# EAGLE design smartFootballTable_Display (EAGLE 8.1.1)
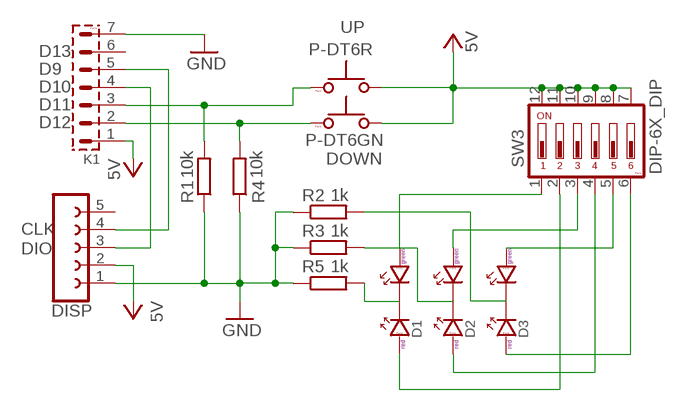
[diagram p0: schematic, sheet 1]

## Parts
D1  LED_DUO_3  [LED_3-DUO]
D2  LED_DUO_3  [LED_3-DUO]
D3  LED_DUO_3  [LED_3-DUO]
DISP  FE05W  [FE05W]
DOWN  P-DT6GN  P-DT6E  [P-DTE6]
K1  PSH02-07W  [PSH02-07W]
R1  10k  R-EU_0204/7  [0204/7]
R2  1k  R-EU_0204/7  [0204/7]
R3  1k  R-EU_0204/7  [0204/7]
R4  10k  R-EU_0204/7  [0204/7]
R5  1k  R-EU_0204/7  [0204/7]
SW3  DIP-6X_DIP  [DIP-6X]
UP  P-DT6R  P-DT6E  [P-DTE6]

## Nets
CLK: DISP.4 K1.5
DIO: DISP.3 K1.4
GND: DISP.1 K1.7 R1.1 R2.1 R3.1 R4.1 R5.1
N$1: K1.3 R1.2 UP.1
N$2: DOWN.1 K1.2 R4.2
N$3: D1.A2 SW3.1
N$4: D2.A1 SW3.4
N$5: D2.A2 SW3.3
N$6: D3.A2 SW3.5
N$7: D3.A1 SW3.6
N$8: D1.A1 SW3.2
N$9: D3.K R2.2
N$10: D2.K R3.2
N$11: D1.K R5.2
VCC: DISP.2 DOWN.2 K1.1 SW3.7 SW3.8 SW3.9 SW3.10 SW3.11 SW3.12 UP.2 ; supply symbol labelled 5V
Unconnected: DISP.5 DOWN.1A DOWN.2A K1.6 UP.1A UP.2A

## Notes on the sheet
- D13
- D9
- D10
- D11
- D12
- CLK
- DIO

## Library data of the parts
D1-D3 = #PaJa_31:LED_DUO: LED dioda - dvoubarevna - 3 vyvody, spol. Katoda
DISP = con-lsta:FE05W: FEMALE HEADER; OC_FARNELL: unknown; OC_NEWARK: unknown
DOWN UP = #PaJa_prepinace:P-DT6: Tlacitkovy spinac
K1 = #PaJa_konektory:PSH02-07: Konektory se zamkem - vidlice - 7pin
R1-R5 = resistor:R-EU_: RESISTOR, European symbol
SW3 = #PaJa_prepinace:DIP-6X: DIP Prepinac - 6x

## Board
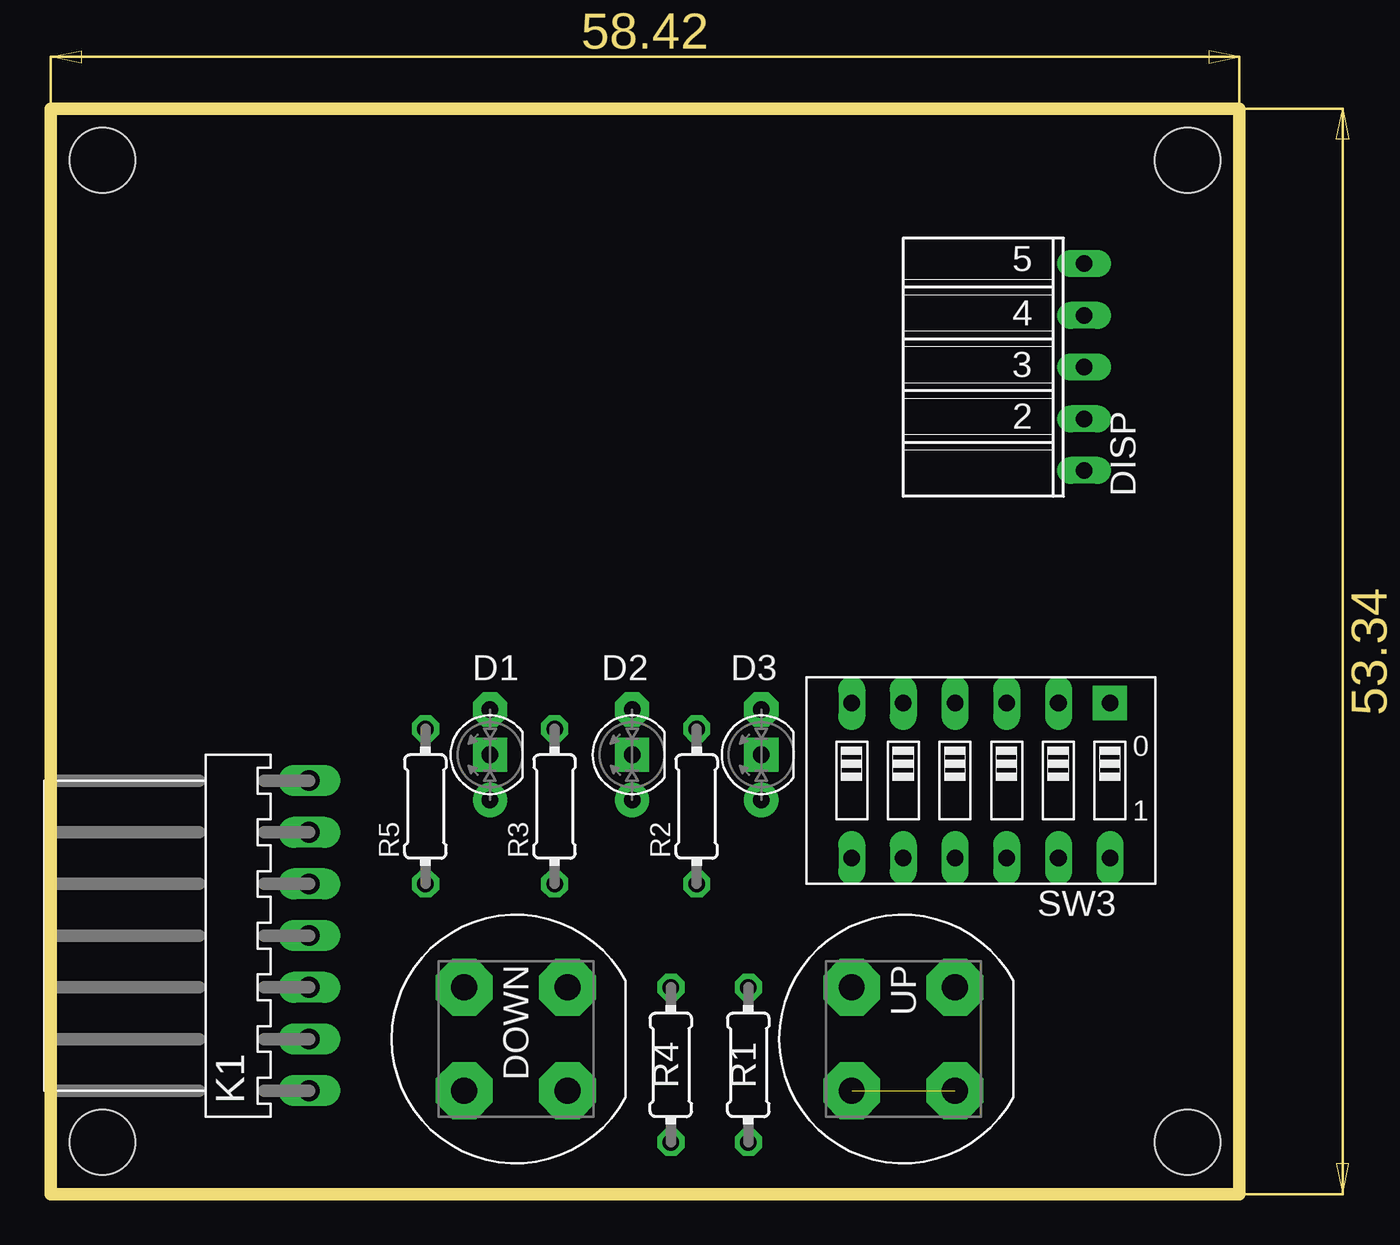
[diagram p1: board, top side]
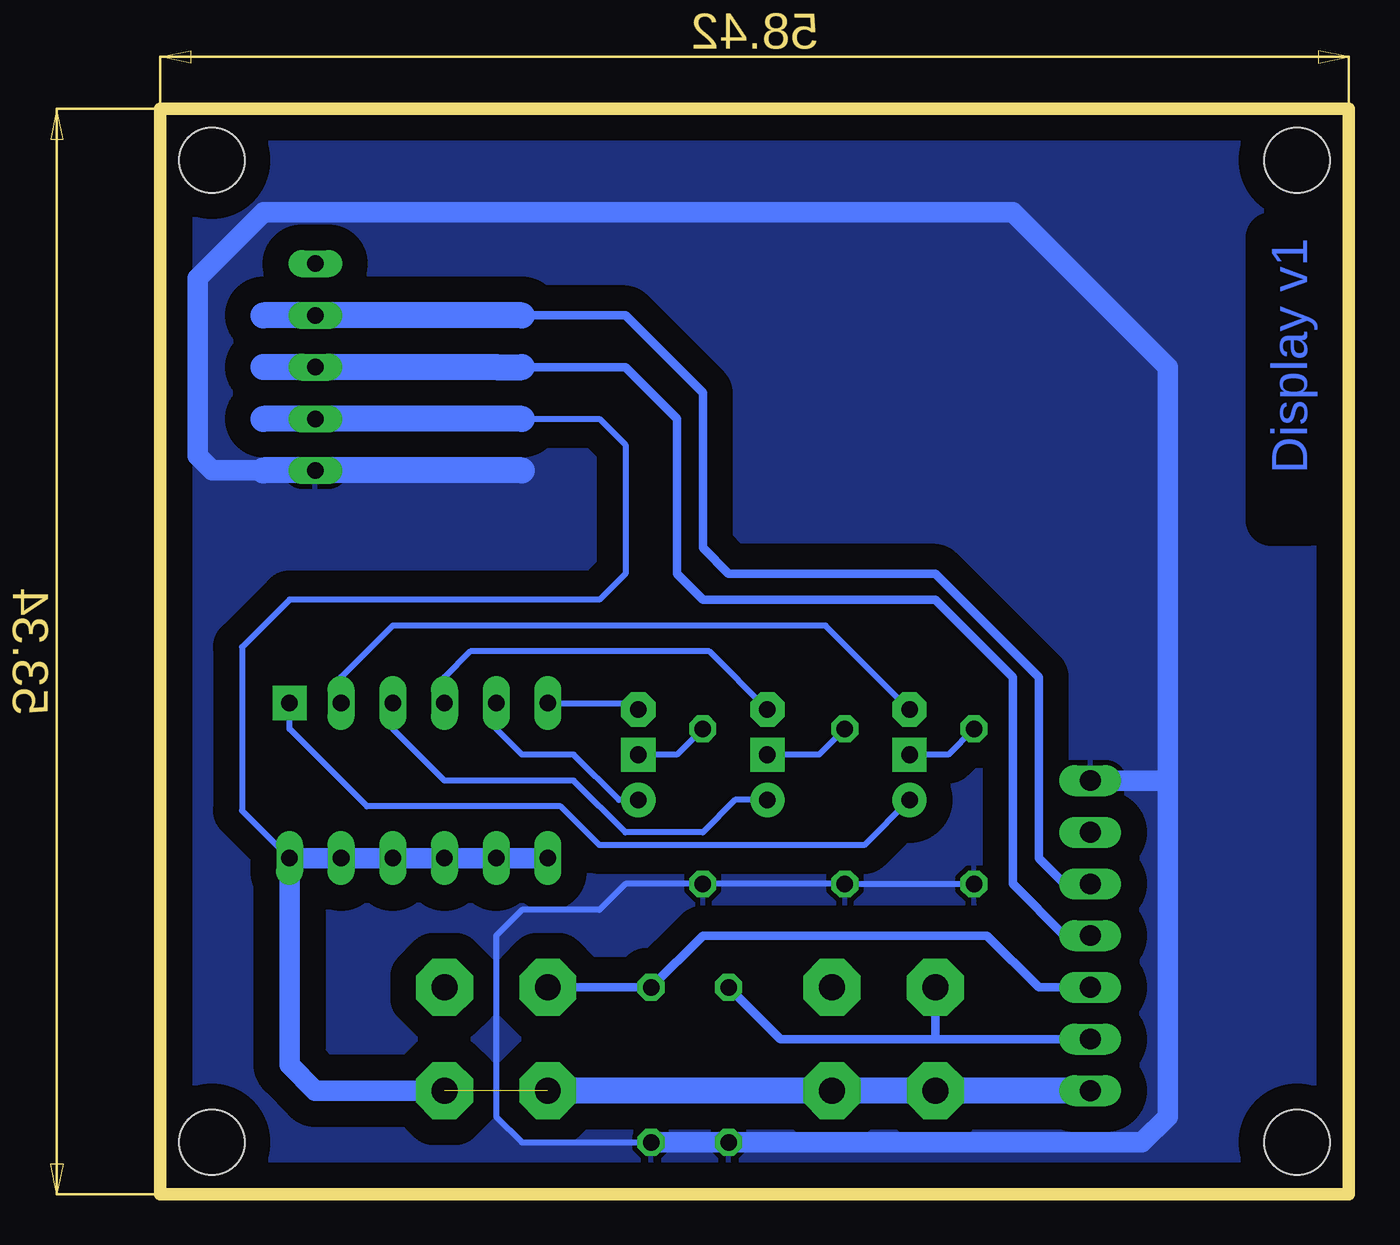
[diagram p2: board, bottom side, seen from below]

Size 58.42 x 53.34 mm. Coordinates in mm from the lower left corner, seen from the top.
Outline: 0,0 0,53.34 58.42,53.34 58.42,0 0,0
Copper layers (1*16): Top 0.035mm / dielectric 1.5mm / Bottom 0.035mm
Design rules "default": minimum track width 10mil, minimum drill 24mil, track to track 8mil, track to pad 8mil, pad to pad 8mil, via to via 8mil, smd to smd 8mil, copper to edge 40mil, drill to drill 8mil, minimum pad ring 10mil, minimum via ring 8mil, stop-mask expansion 4mil, vias tented up to drill 0mil, thermal gap 10mil
Holes 3.2 mm at 2.54,50.8 2.54,2.54 55.88,50.8 55.88,2.54

### Footprints (pad centres in the part's own frame; a part is rotated, then mirrored left to right if it is on the bottom)
LED_3-DUO = drill 0.813 pad 1.676 octagon: A1 2.223,0 | drill 0.813 pad 1.676: A2 -2.223,0 | drill 0.813 pad 1.676 square: K 0,0
FE05W = drill 0.813 long: 1 -5.08,0; 2 -2.54,0; 3 0,0; 4 2.54,0; 5 5.08,0
P-DTE6 = drill 1.27 pad 2.8 octagon: 1 -2.54,-2.54; 1A -2.54,2.54; 2 2.54,-2.54; 2A 2.54,2.54
PSH02-07W = drill 1.016 pad 1.422 long: 1 -7.62,0; 2 -5.08,0; 3 -2.54,0; 4 0,0; 5 2.54,0; 6 5.08,0; 7 7.62,0
0204/7 = drill 0.813 octagon: 1 -3.81,0; 2 3.81,0
DIP-6X = drill 0.813 pad 1.676 square: 1 -6.35,-3.81 | drill 0.813 pad 1.27 long: 2 -3.81,-3.81; 3 -1.27,-3.81; 4 1.27,-3.81; 5 3.81,-3.81; 6 6.35,-3.81; 7 6.35,3.81; 8 3.81,3.81; 9 1.27,3.81; 10 -1.27,3.81; 11 -3.81,3.81; 12 -6.35,3.81

### Placement (x,y rotation side)
D1  21.59,21.59 90 top
D2  28.57,21.59 90 top
D3  34.92,21.59 90 top
DISP  50.8,40.64 90 top
DOWN  22.86,7.62 270 top
K1  12.7,12.7 90 top
R1  34.29,6.35 90 top
R2  31.75,19.05 90 top
R3  24.77,19.05 90 top
R4  30.48,6.35 90 top
R5  18.41,19.05 90 top
SW3  45.72,20.32 180 top
UP  41.91,7.62 270 top

### Tracks (layer width: path | path; a pad name or v marks a point on that pad's centre or on a via)
CLK
  Bottom 0.406: K1.5 13.97,15.24 15.24,16.51 15.24,25.4 20.32,30.48 30.48,30.48 31.75,31.75 31.75,39.37 35.56,43.18 40.64,43.18
  Bottom 1.27: 40.64,43.18 DISP.4 53.34,43.18
DIO
  Bottom 0.406: K1.4 13.97,12.7 16.51,15.24 16.51,25.4 20.32,29.21 31.75,29.21 33.02,30.48 33.02,38.1 35.56,40.64 41.91,40.64
  Bottom 1.27: 40.64,40.64 41.91,40.64 DISP.3 53.34,40.64
GND
  Bottom 0.305: R5.1 R3.1 R2.1 35.56,15.24 36.83,13.97 40.64,13.97 41.91,12.7 41.91,3.81 40.64,2.54 R1.1
  Bottom 1.016: 8.89,20.32 8.89,40.64 16.51,48.26 53.34,48.26 56.59,45.01 56.59,36.27 55.88,35.56 53.34,35.56 | 8.89,20.32 8.89,3.81 10.16,2.54 R4.1 R1.1 | K1.7 8.89,20.32
  Bottom 1.27: 40.64,35.56 DISP.1 53.34,35.56
  pour Bottom (isolate 1.27): -1.27,54.61 59.69,54.61 59.69,-1.27 -1.27,-1.27
N$1
  Bottom 0.406: K1.3 15.24,10.16 17.78,12.7 31.75,12.7 R1.2 UP.1
N$2
  Bottom 0.406: 20.32,7.62 K1.2 | 20.32,7.62 27.94,7.62 R4.2 | DOWN.1 20.32,7.62
N$3
  Bottom 0.305: D1.A2 23.81,17.14 36.83,17.14 38.73,19.05 48.26,19.05 52.07,22.86 SW3.1
N$4
  Bottom 0.305: D2.A1 31.43,26.67 43.18,26.67 44.45,25.4 SW3.4
N$5
  Bottom 0.305: D2.A2 30.16,19.37 31.75,17.78 35.56,17.78 38.1,20.32 44.45,20.32 46.99,22.86 SW3.3
N$6
  Bottom 0.305: D3.A2 35.88,19.37 38.1,21.59 40.64,21.59 41.91,22.86 SW3.5
N$7
  Bottom 0.305: SW3.6 35.24,24.13 D3.A1
N$8
  Bottom 0.305: D1.A1 25.72,27.94 46.99,27.94 49.53,25.4 SW3.2
N$9
  Bottom 0.305: R2.2 33.02,21.59 D3.K
N$10
  Bottom 0.305: R3.2 26.04,21.59 D2.K
N$11
  Bottom 0.305: R5.2 19.68,21.59 D1.K
VCC  (1 unrouted)
  Bottom 0.305: 40.64,38.1 36.83,38.1 35.56,36.83 35.56,30.48 36.83,29.21 52.07,29.21 54.41,26.87 54.41,18.85 SW3.12
  Bottom 0.406: SW3.12 52.07,13.01 | 49.53,5.08 44.45,5.08
  Bottom 1.016: SW3.7 SW3.8 SW3.9 SW3.10 SW3.11 SW3.12 52.07,6.35 50.8,5.08 44.45,5.08
  Bottom 1.27: UP.2 DOWN.2 K1.1 | 40.64,38.1 DISP.2 53.34,38.1

### Text on the board
Bottom: Display v1